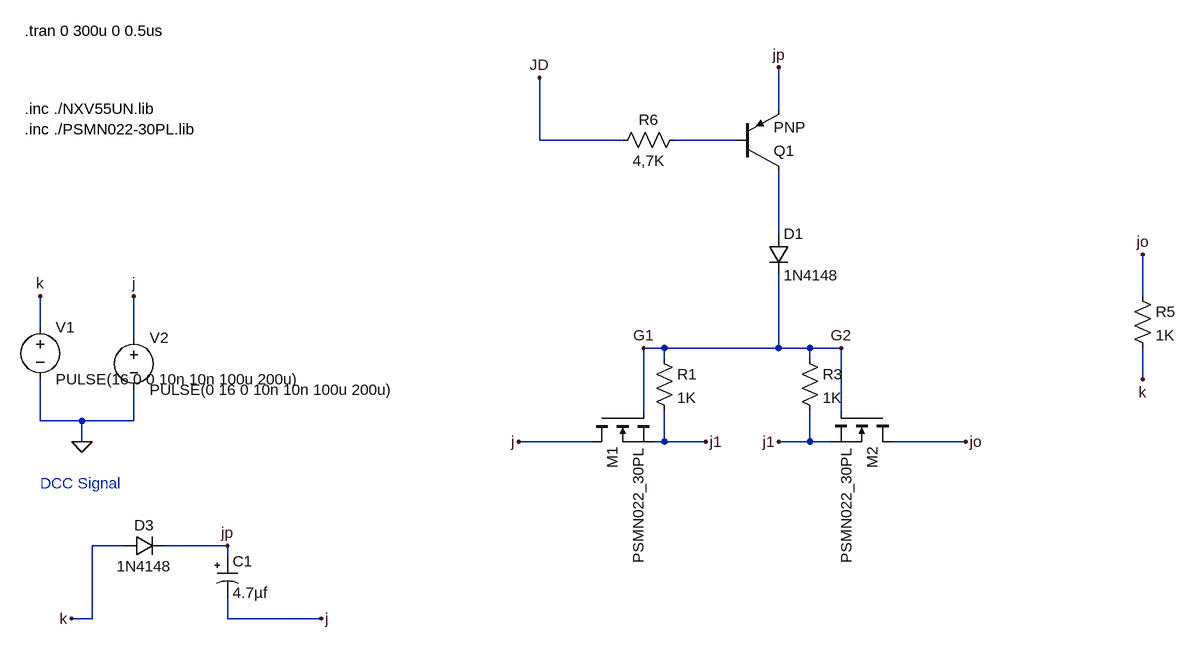
[diagram p0: schematic dccAbc-psm3.asc]
dccAbc-psm3.asc, the LTspice schematic file:
Version 4
SHEET 1 880 680
WIRE -720 -1024 -720 -1088
WIRE -1088 -976 -1088 -1072
WIRE -960 -976 -1088 -976
WIRE -784 -976 -880 -976
WIRE -720 -832 -720 -928
WIRE -160 -736 -160 -800
WIRE -1856 -688 -1856 -736
WIRE -1712 -672 -1712 -736
WIRE -896 -656 -928 -656
WIRE -720 -656 -720 -768
WIRE -720 -656 -896 -656
WIRE -672 -656 -720 -656
WIRE -624 -656 -672 -656
WIRE -896 -640 -896 -656
WIRE -672 -640 -672 -656
WIRE -160 -608 -160 -656
WIRE -928 -560 -928 -656
WIRE -624 -560 -624 -656
WIRE -1856 -544 -1856 -608
WIRE -1792 -544 -1856 -544
WIRE -1712 -544 -1712 -592
WIRE -1712 -544 -1792 -544
WIRE -1792 -512 -1792 -544
WIRE -1008 -512 -1120 -512
WIRE -896 -512 -896 -560
WIRE -896 -512 -912 -512
WIRE -832 -512 -896 -512
WIRE -672 -512 -672 -560
WIRE -672 -512 -720 -512
WIRE -640 -512 -672 -512
WIRE -432 -512 -544 -512
WIRE -1728 -352 -1776 -352
WIRE -1568 -352 -1664 -352
WIRE -1568 -336 -1568 -352
WIRE -1776 -240 -1776 -352
WIRE -1776 -240 -1808 -240
WIRE -1568 -240 -1568 -272
WIRE -1424 -240 -1568 -240
FLAG -1792 -512 0
FLAG -1712 -736 j
FLAG -1856 -736 k
FLAG -1120 -512 j
FLAG -832 -512 j1
FLAG -432 -512 jo
FLAG -160 -800 jo
FLAG -160 -608 k
FLAG -1808 -240 k
FLAG -1424 -240 j
FLAG -1568 -352 jp
FLAG -720 -512 j1
FLAG -720 -1088 jp
FLAG -1088 -1072 JD
FLAG -928 -656 G1
FLAG -624 -656 G2
SYMBOL voltage -1712 -688 R0
SYMATTR InstName V2
SYMATTR Value PULSE(0 16 0 10n 10n 100u 200u)
SYMBOL voltage -1856 -704 R0
SYMATTR InstName V1
SYMATTR Value PULSE(16 0 0 10n 10n 100u 200u)
SYMBOL nmos -1008 -560 M90
SYMATTR InstName M1
SYMATTR Value PSMN022_30PL
SYMATTR Prefix X
SYMBOL nmos -544 -560 R90
SYMATTR InstName M2
SYMATTR Value PSMN022_30PL
SYMATTR Prefix X
SYMBOL res -912 -656 R0
SYMATTR InstName R1
SYMATTR Value 1K
SYMBOL res -688 -656 R0
SYMATTR InstName R3
SYMATTR Value 1K
SYMBOL res -176 -752 R0
SYMATTR InstName R5
SYMATTR Value 1K
SYMBOL polcap -1584 -336 R0
SYMATTR InstName C1
SYMATTR Value 4.7µf
SYMBOL diode -1728 -336 R270
WINDOW 0 32 32 VTop 2
WINDOW 3 0 32 VBottom 2
SYMATTR InstName D3
SYMATTR Value 1N4148
SYMBOL pnp -784 -928 M180
SYMATTR InstName Q1
SYMBOL res -864 -992 R90
WINDOW 0 0 56 VBottom 2
WINDOW 3 32 56 VTop 2
SYMATTR InstName R6
SYMATTR Value 4,7K
SYMBOL diode -736 -832 R0
SYMATTR InstName D1
SYMATTR Value 1N4148
TEXT -1880 -1144 Left 2 !.tran 0 300u 0 0.5us
TEXT -1856 -448 Left 2 ;DCC Signal
TEXT -1880 -1024 Left 2 !.inc ./NXV55UN.lib\n.inc ./PSMN022-30PL.lib

The netlist it stands for:
* dccAbc-psm3.asc
V2 j 0 PULSE(0 16 0 10n 10n 100u 200u)
V1 k 0 PULSE(16 0 0 10n 10n 100u 200u)
XM1 j G2 j1 PSMN022_30PL  ; pins D G S
XM2 jo G2 j1 PSMN022_30PL  ; pins D G S
R1 G2 j1 1K
R3 G2 j1 1K
R5 jo k 1K
C1 jp j 4.7µf
D3 k jp 1N4148
Q1 N002 N001 jp 0 PNP
R6 N001 JD 4,7K
D1 N002 G2 1N4148
.model D D
.lib standard.dio
.model NPN NPN
.model PNP PNP
.lib standard.bjt
.tran 0 300u 0 0.5us
* DCC Signal
.inc ./NXV55UN.lib
.inc ./PSMN022-30PL.lib
.backanno
.end